# EAGLE design Pi OLED V (EAGLE 9.6.2)
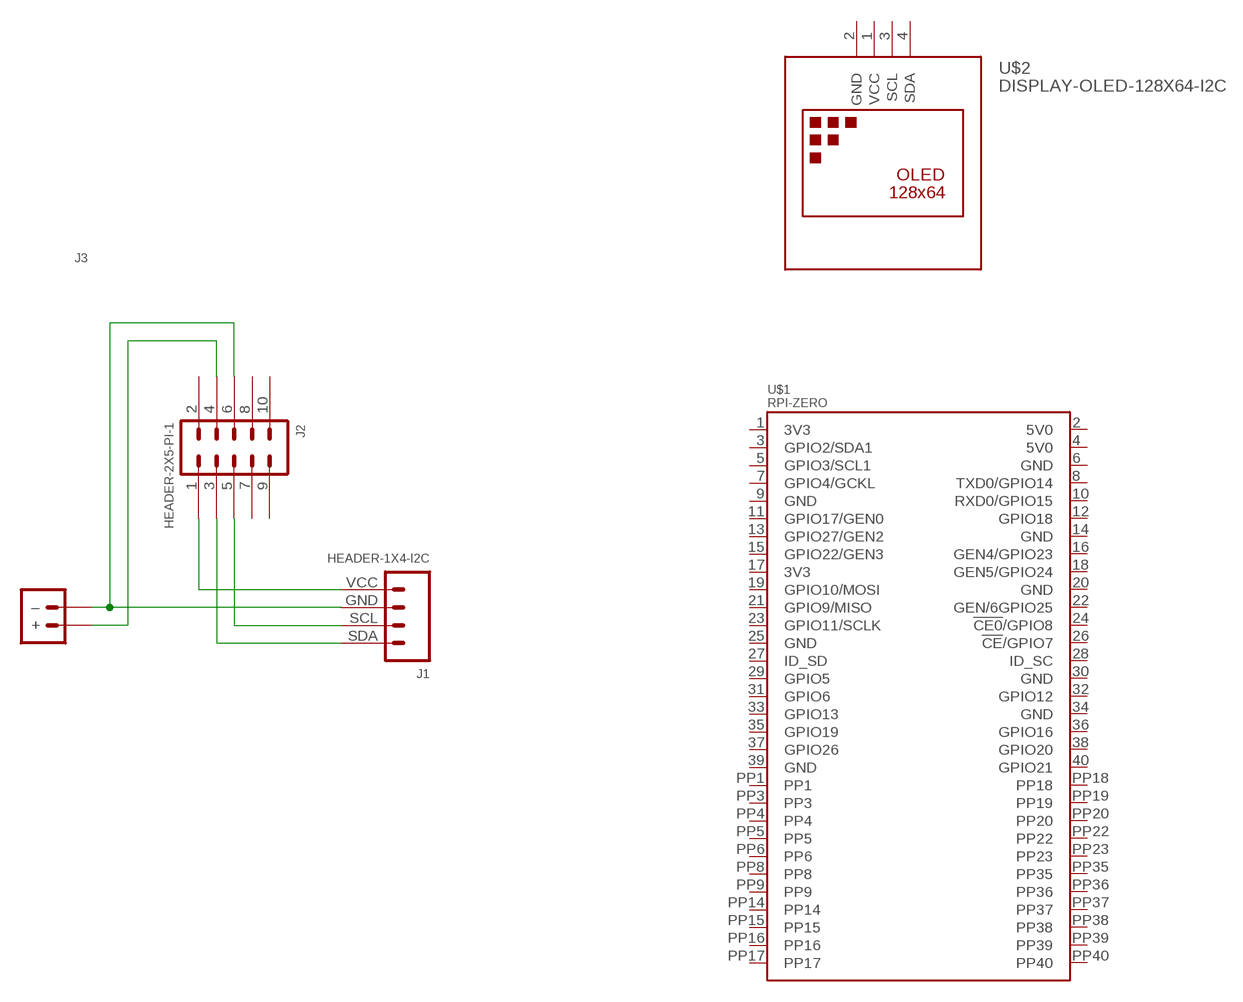
[diagram p0: schematic, sheet 1]

## Parts
J1  HEADER-1X4-I2C  [CONN_04-I2C]
J2  HEADER-2X5-PI-1  [CONN_2X5-PI-1]
J3  JST-PH2.0-2-HORIZONTAL-POWERJST-PTH-2  [JST-PH2.0-2-HORIZONTAL-POWER]
U$1  RPI-ZERO  [RASP_PI_ZERO_BOARD_FULL]
U$2  DISPLAY-OLED-128X64-I2C  [DISPLAY-OLED-128X64-I2C]

## Nets
N$1: J1.GND J2.6 J3.-(–)
N$2: J2.4 J3.+
N$3: J1.VCC J2.1
N$4: J1.SDA J2.3
N$5: J1.SCL J2.5
Unconnected: J2.2 J2.7 J2.8 J2.9 J2.10 U$1.1(3V3) U$1.2(5V0) U$1.3(GPIO2/SDA1) U$1.4(5V0) U$1.5(GPIO3/SCL1) U$1.6(GND) U$1.7(GPIO4/GCKL) U$1.8(TXD0/GPIO14) U$1.9(GND) U$1.10(RXD0/GPIO15) U$1.11(GPIO17/GEN0) U$1.12(GPIO18) U$1.13(GPIO27/GEN2) U$1.14(GND) U$1.15(GPIO22/GEN3) U$1.16(GEN4/GPIO23) U$1.17(3V3) U$1.18(GEN5/GPIO24) U$1.19(GPIO10/MOSI) U$1.20(GND) U$1.21(GPIO9/MISO) U$1.22(GEN/6GPIO25) U$1.23(GPIO11/SCLK) U$1.24(!CE0!/GPIO8) U$1.25(GND) U$1.26(!CE!/GPIO7) U$1.27(ID_SD) U$1.28(ID_SC) U$1.29(GPIO5) U$1.30(GND) U$1.31(GPIO6) U$1.32(GPIO12) U$1.33(GPIO13) U$1.34(GND) U$1.35(GPIO19) U$1.36(GPIO16) U$1.37(GPIO26) U$1.38(GPIO20) U$1.39(GND) U$1.40(GPIO21) U$1.PP1 U$1.PP3 U$1.PP4 U$1.PP5 U$1.PP6 U$1.PP8 U$1.PP9 U$1.PP14 U$1.PP15 U$1.PP16 U$1.PP17 U$1.PP18 U$1.PP19 U$1.PP20 U$1.PP22 U$1.PP23 U$1.PP35 U$1.PP36 U$1.PP37 U$1.PP38 U$1.PP39 U$1.PP40 U$2.3(SCL) U$2.4(SDA)

## Power pins joined to a net without a drawn wire
GND: U$2.2(GND)
VCC: U$2.1(VCC)

## Library data of the parts
J1 = digitalconcepts:HEADER-1X4-I2C: I2C Interface [Pin 1 Vcc] 4-Pin Header
J2 = digitalconcepts:HEADER-2X5-PI-1: Ras-Pi 2x5 PTH Header Rapsberry Pi, starting at Pin 1
J3 = digitalconcepts:JST-PH2.0-2-HORIZONTAL-POWER: PH2.0 2P Right Angle PCB Connector; PROD_ID: CONN-09863; SKU: PRT-09914
U$1 = rpi-zero:RPI-ZERO
U$2 = digitalconcepts:DISPLAY-OLED-128X64-I2C: 128x64 Dot Matrix OLED Module based on SSD1306 chip Variant with I2C interface More details available here: http://www.instructables.com/id/Monochrome-096-i2c-OLED-display-with-arduino-SSD13/ SSD1306 datasheet: https://cdn-shop.adafruit.com/datasheets/SSD1306.pdf Click here to find device on ebay.com <http://www.ebay.com/sch/oled+display+128x64+iic> Note: There are two variants: I2C and SPI. Search for the proper version.

## Board
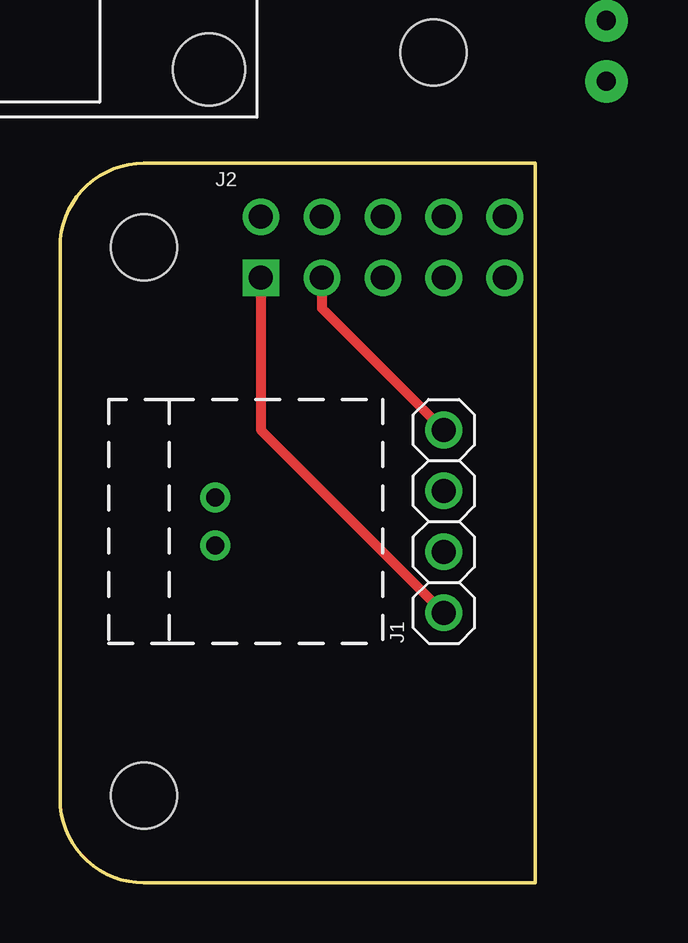
[diagram p1: board, top side]
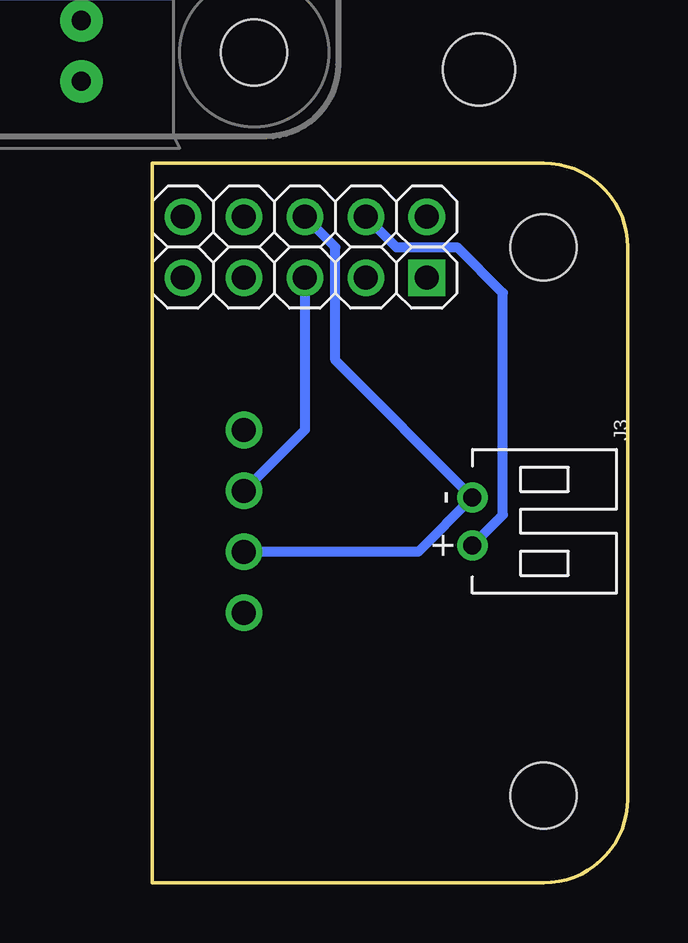
[diagram p2: board, bottom side, seen from below]

Size 19.8 x 30 mm. Coordinates in mm from the lower left corner, seen from the top.
Outline: 19.8,30 19.8,0 3.5,0 arc-90 0,3.5 0,26.5 arc-90 3.5,30 19.8,30
Copper layers (1*16): Top 0.035mm / dielectric 1.5mm / Bottom 0.035mm
Design rules "default *": minimum track width 6mil, minimum drill 0.35mm, track to track 6mil, track to pad 6mil, pad to pad 6mil, via to via 6mil, smd to smd 6mil, copper to edge 6mil, drill to drill 6mil, minimum pad ring 10mil, minimum via ring 8mil, stop-mask expansion 4mil, vias tented up to drill 0mil, thermal gap 10mil
Holes 2.75 mm at 3.5,26.5 3.5,3.64

### Footprints (pad centres in the part's own frame; a part is rotated, then mirrored left to right if it is on the bottom)
CONN_04-I2C = drill 1 pad 1.524: GND 2.54,0; SCL 5.08,0; SDA 7.62,0; VCC 0,0
CONN_2X5-PI-1 = drill 1 pad 1.524 square: 1 0,0 | drill 1 pad 1.524: 2 0,2.54; 3 2.54,0; 4 2.54,2.54; 5 5.08,0; 6 5.08,2.54; 7 7.62,0; 8 7.62,2.54; 9 10.16,0; 10 10.16,2.54
JST-PH2.0-2-HORIZONTAL-POWER = drill 0.75: + 1,0; - -1,0
RASP_PI_ZERO_BOARD_FULL = drill 1 pad 1.778 square: 1 8.37,25.23 | drill 1 pad 1.778: 2 8.37,27.77; 3 10.91,25.23; 4 10.91,27.77; 5 13.45,25.23; 6 13.45,27.77; 7 15.99,25.23; 8 15.99,27.77; 9 18.53,25.23; 10 18.53,27.77; 11 21.07,25.23; 12 21.07,27.77; 13 23.61,25.23; 14 23.61,27.77; 15 26.15,25.23; 16 26.15,27.77; 17 28.69,25.23; 18 28.69,27.77; 19 31.23,25.23; 20 31.23,27.77; 21 33.77,25.23; 22 33.77,27.77; 23 36.31,25.23; 24 36.31,27.77; 25 38.85,25.23; 26 38.85,27.77; 27 41.39,25.23; 28 41.39,27.77; 29 43.93,25.23; 30 43.93,27.77; 31 46.47,25.23; 32 46.47,27.77; 33 49.01,25.23; 34 49.01,27.77; 35 51.55,25.23; 36 51.55,27.77; 37 54.09,25.23; 38 54.09,27.77; 39 56.63,25.23; 40 56.63,27.77 | drill 0.8 pad 1.778: PP1 10.699,4.832; PP3 7.593,8.858; PP4 7.133,14.38; PP5 55.796,23.124; PP6 10.699,2.301; PP8 5.177,8.858; PP9 9.549,14.38; PP14 58.327,18.407; PP15 55.796,14.265; PP16 55.796,20.363; PP17 58.212,21.743; PP18 55.796,17.027; PP19 58.327,15.186; PP20 56.832,9.434; PP35 17.257,2.416; PP36 60.628,12.425; PP37 56.026,2.071; PP38 53.726,2.416; PP39 58.097,12.54; PP40 18.867,6.212 | drill 0.8 pad 1.422: PP22 23.009,2.071; PP23 24.734,2.071 | hole 2.75: 3.5,3.5; 3.5,26.5; 61.5,3.5; 61.5,26.5
DISPLAY-OLED-128X64-I2C = drill 1 square: 1 -3.81,0 | drill 1: 2 -1.27,0; 3 1.27,0; 4 3.81,0 | hole 3: -11,-0.5; 11,-0.5; 11,-24.5; -11,-24.5

### Placement (x,y rotation side)
J1  15.99,11.26 90 top
J2  8.37,25.23 0 top
J3  6.47,15.07 270 bottom
U$1  12.06,31.12 0 top  (outside the outline)
U$2  -18.3,44.91 90 top  (outside the outline)

### Tracks (layer width: path | path; a pad name or v marks a point on that pad's centre or on a via)
N$1
  Bottom 0.406: J2.6 12.18,26.5 12.18,21.78 J3.- 8.74,13.8 J1.GND
N$2
  Bottom 0.406: J3.+ 5.2,15.34 5.2,24.59 7.1,26.5 9.64,26.5 J2.4
N$3
  Top 0.406: J1.VCC 8.37,18.88 J2.1
N$4
  Top 0.406: J2.3 10.91,23.96 J1.SDA
N$5
  Bottom 0.406: J2.5 13.45,18.88 J1.SCL